# Altium schematic sheet 01-CM4_Conn.SchDoc
size C; SheetNumber: 1; SheetTotal: 13
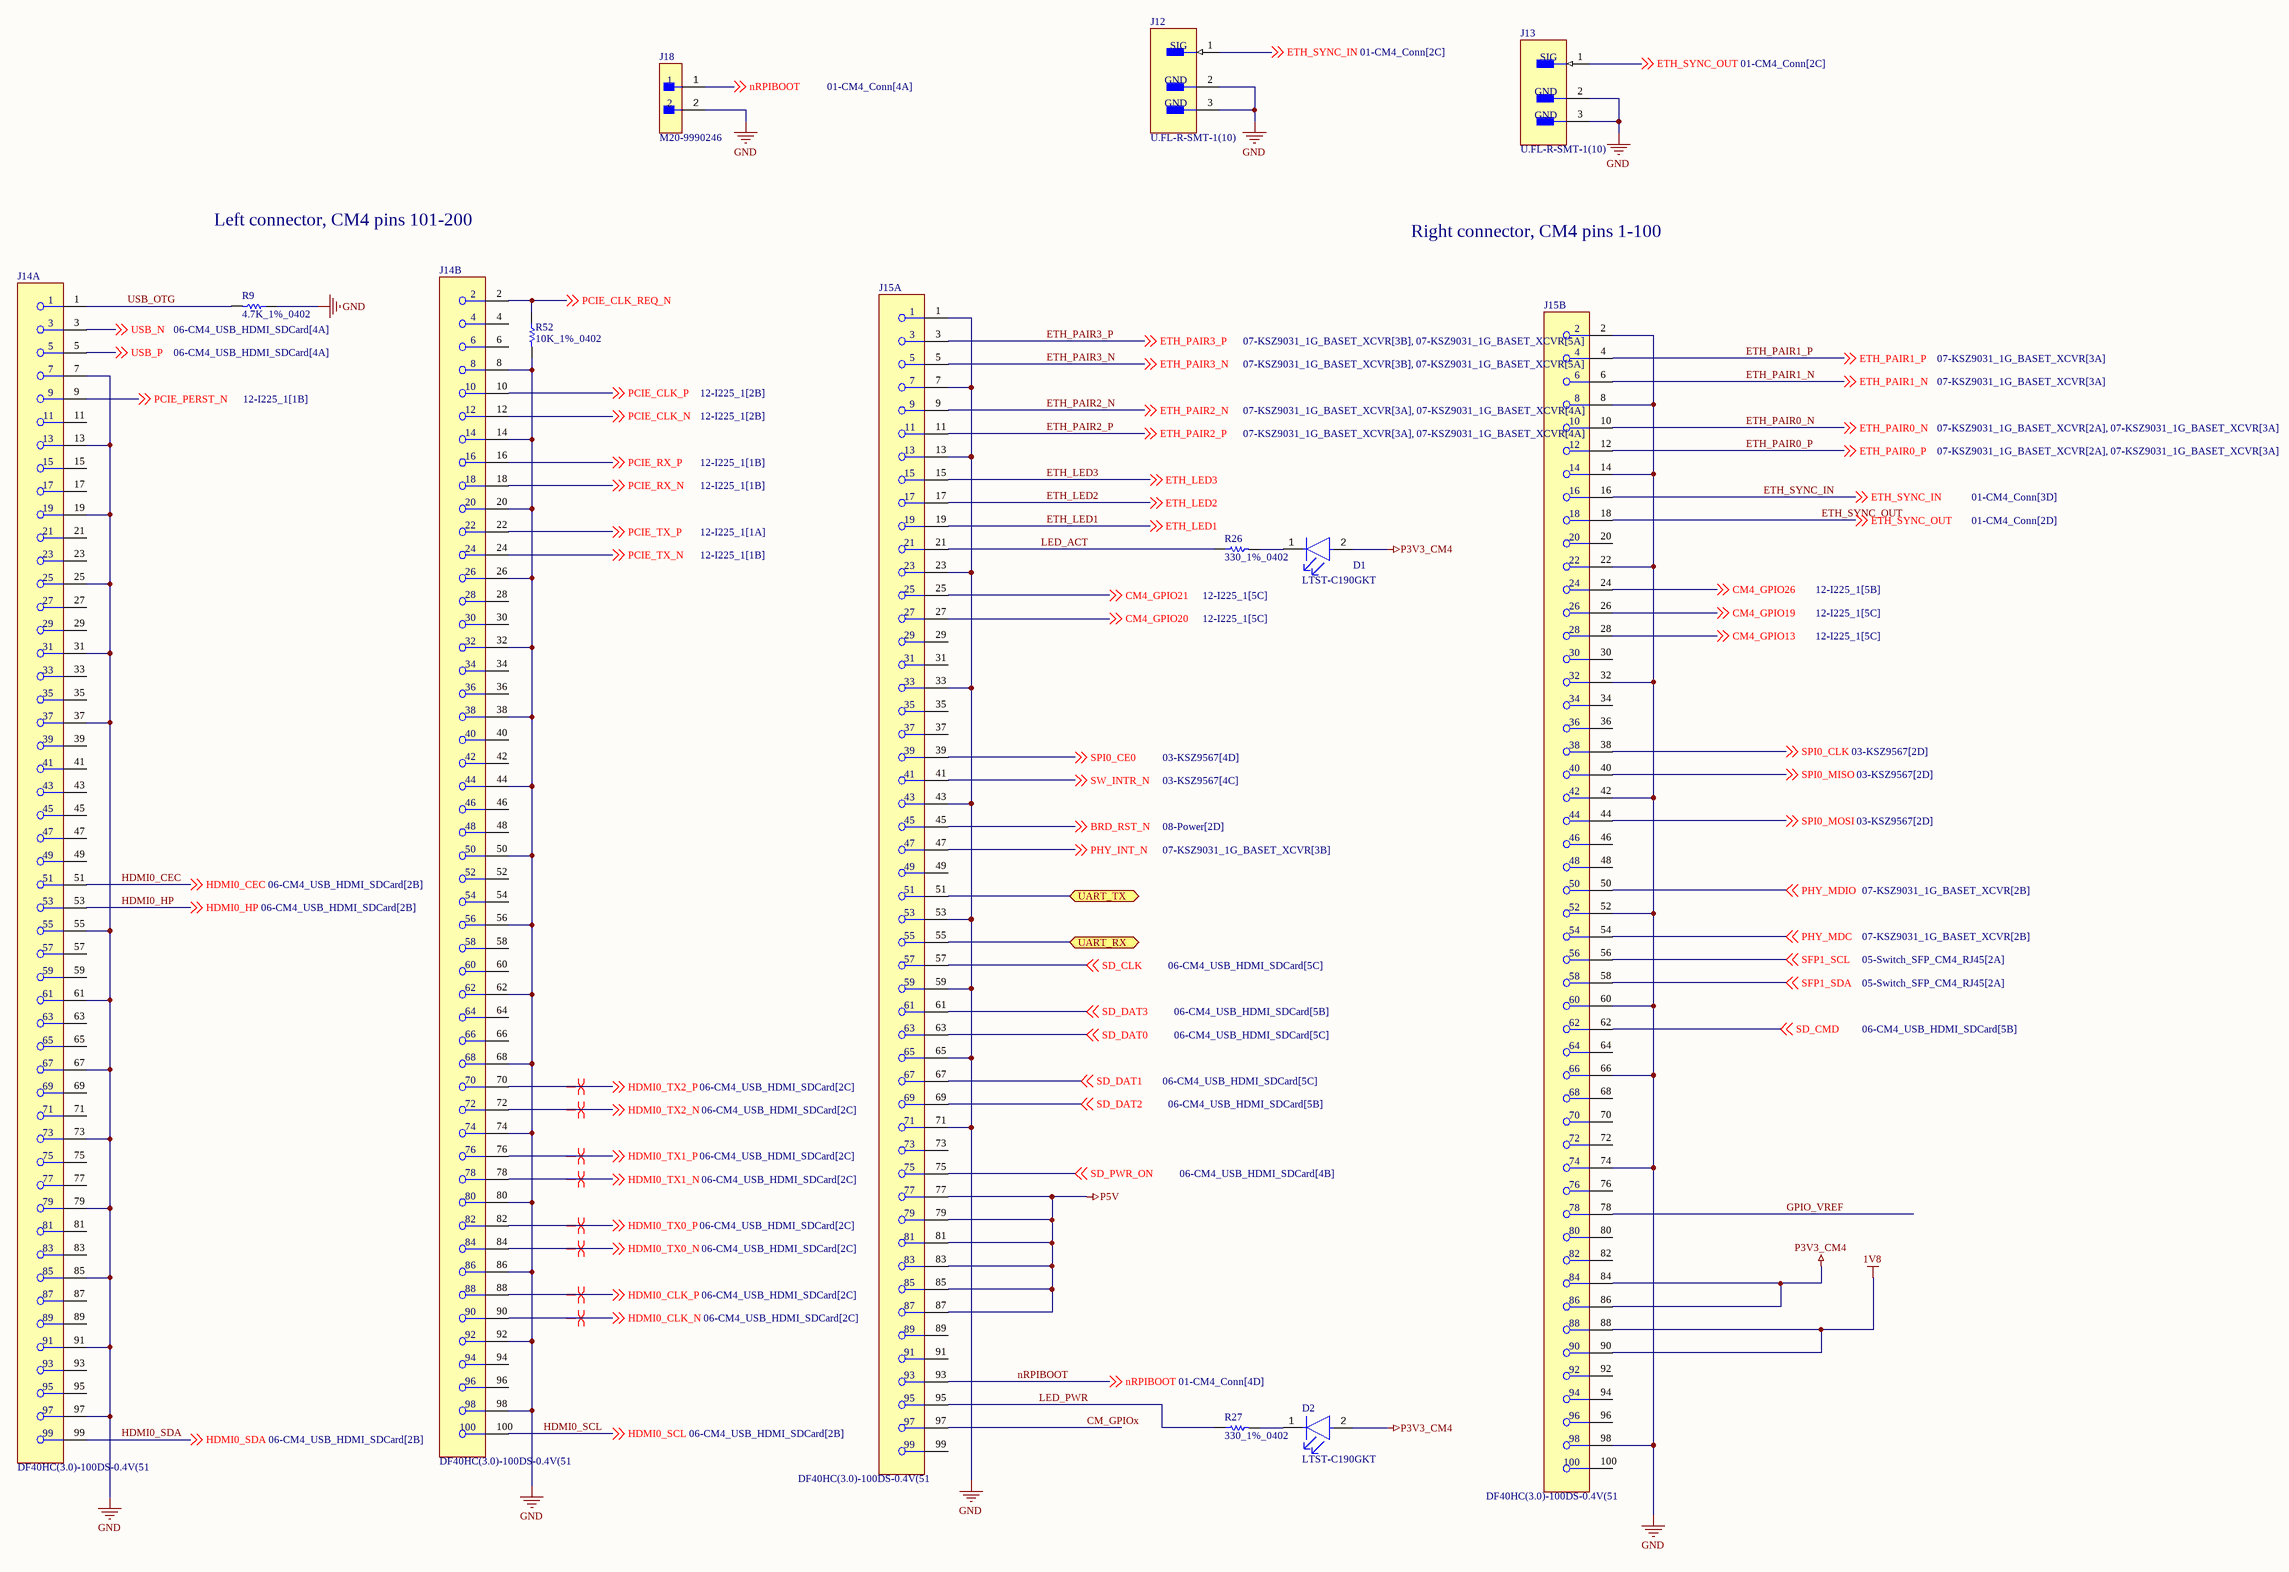
[diagram p0: 01-CM4_Conn.SchDoc]

## Parts
D1  LTST-C190GKT  [FP-LTST-C190GKT-MFG]
D2  LTST-C190GKT  [FP-LTST-C190GKT-MFG]
J12  U.FL-R-SMT-1(10)  [FP-U_FL-R-SMT-1_10-MFG]
J13  U.FL-R-SMT-1(10)  [FP-U_FL-R-SMT-1_10-MFG]
J14  DF40HC(3.0)-100DS-0.4V(51  [FP-DF40HC_3_0_-100DS-0_4V-MFG]  (parts A,B of 2)
J15  DF40HC(3.0)-100DS-0.4V(51  [FP-DF40HC_3_0_-100DS-0_4V-MFG]  (parts A,B of 2)
J18  M20-9990246  [FP-M20-9990246-MFG]
R9  4.7K_1%_0402  [RESC1005X40X25NL10T10]
R26  330_1%_0402  [RESC1005X40X25NL10T10]
R27  330_1%_0402  [RESC1005X40X25NL10T10]
R52  10K_1%_0402  [RESC1005X40X25NL10T10]

## Ports
UART_RX (bidir), UART_TX (bidir)

## Nets
1V8: J15.88 J15.90
GND: J12.2(GND) J12.3(GND) J13.2(GND) J13.3(GND) J14.7 J14.8 J14.13 J14.14 J14.19 J14.20 J14.25 J14.26 J14.31 J14.32 J14.37 J14.38 J14.44 J14.50 J14.55 J14.56 J14.61 J14.62 J14.67 J14.68 J14.73 J14.74 J14.79 J14.80 J14.85 J14.86 J14.91 J14.92 J14.97 J14.98 J15.1 J15.2 J15.7 J15.8 J15.13 J15.14 J15.22 J15.23 J15.32 J15.33 J15.42 J15.43 J15.52 J15.53 J15.59 J15.60 J15.65 J15.66 J15.71 J15.74 J15.98 J18.2 R9.1 R52.2
P3V3_CM4: D1.2(A) D2.2(A) J15.84 J15.86
P5V: J15.77 J15.79 J15.81 J15.83 J15.85 J15.87
BRD_RST_N: J15.45 ; off-sheet BRD_RST_N
CM4_GPIO13: J15.28 ; off-sheet CM4_GPIO13
CM4_GPIO19: J15.26 ; off-sheet CM4_GPIO19
CM4_GPIO20: J15.27 ; off-sheet CM4_GPIO20
CM4_GPIO21: J15.25 ; off-sheet CM4_GPIO21
CM4_GPIO26: J15.24 ; off-sheet CM4_GPIO26
CM_GPIOx: J15.97
ETH_LED1: J15.19 ; off-sheet ETH_LED1
ETH_LED2: J15.17 ; off-sheet ETH_LED2
ETH_LED3: J15.15 ; off-sheet ETH_LED3
ETH_PAIR0_N: J15.10 ; off-sheet ETH_PAIR0_N
ETH_PAIR0_P: J15.12 ; off-sheet ETH_PAIR0_P
ETH_PAIR1_N: J15.6 ; off-sheet ETH_PAIR1_N
ETH_PAIR1_P: J15.4 ; off-sheet ETH_PAIR1_P
ETH_PAIR2_N: J15.9 ; off-sheet ETH_PAIR2_N
ETH_PAIR2_P: J15.11 ; off-sheet ETH_PAIR2_P
ETH_PAIR3_N: J15.5 ; off-sheet ETH_PAIR3_N
ETH_PAIR3_P: J15.3 ; off-sheet ETH_PAIR3_P
ETH_SYNC_IN: J12.1(SIG) J15.16 ; off-sheet ETH_SYNC_IN
ETH_SYNC_OUT: J13.1(SIG) J15.18 ; off-sheet ETH_SYNC_OUT
GPIO_VREF: J15.78
HDMI0_CEC: J14.51 ; off-sheet HDMI0_CEC
HDMI0_CLK_N: J14.90 ; off-sheet HDMI0_CLK_N
HDMI0_CLK_P: J14.88 ; off-sheet HDMI0_CLK_P
HDMI0_HP: J14.53 ; off-sheet HDMI0_HP
HDMI0_SCL: J14.100 ; off-sheet HDMI0_SCL
HDMI0_SDA: J14.99 ; off-sheet HDMI0_SDA
HDMI0_TX0_N: J14.84 ; off-sheet HDMI0_TX0_N
HDMI0_TX0_P: J14.82 ; off-sheet HDMI0_TX0_P
HDMI0_TX1_N: J14.78 ; off-sheet HDMI0_TX1_N
HDMI0_TX1_P: J14.76 ; off-sheet HDMI0_TX1_P
HDMI0_TX2_N: J14.72 ; off-sheet HDMI0_TX2_N
HDMI0_TX2_P: J14.70 ; off-sheet HDMI0_TX2_P
LED_ACT: J15.21 R26.1
LED_PWR: J15.95 R27.1
nRPIBOOT: J15.93 J18.1 ; off-sheet nRPIBOOT
PCIE_CLK_N: J14.12 ; off-sheet PCIE_CLK_N
PCIE_CLK_P: J14.10 ; off-sheet PCIE_CLK_P
PCIE_CLK_REQ_N: J14.2 R52.1 ; off-sheet PCIE_CLK_REQ_N
PCIE_PERST_N: J14.9 ; off-sheet PCIE_PERST_N
PCIE_RX_N: J14.18 ; off-sheet PCIE_RX_N
PCIE_RX_P: J14.16 ; off-sheet PCIE_RX_P
PCIE_TX_N: J14.24 ; off-sheet PCIE_TX_N
PCIE_TX_P: J14.22 ; off-sheet PCIE_TX_P
PHY_INT_N: J15.47 ; off-sheet PHY_INT_N
PHY_MDC: J15.54 ; off-sheet PHY_MDC
PHY_MDIO: J15.50 ; off-sheet PHY_MDIO
SD_CLK: J15.57 ; off-sheet SD_CLK
SD_CMD: J15.62 ; off-sheet SD_CMD
SD_DAT0: J15.63 ; off-sheet SD_DAT0
SD_DAT1: J15.67 ; off-sheet SD_DAT1
SD_DAT2: J15.69 ; off-sheet SD_DAT2
SD_DAT3: J15.61 ; off-sheet SD_DAT3
SD_PWR_ON: J15.75 ; off-sheet SD_PWR_ON
SFP1_SCL: J15.56 ; off-sheet SFP1_SCL
SFP1_SDA: J15.58 ; off-sheet SFP1_SDA
SPI0_CE0: J15.39 ; off-sheet SPI0_CE0
SPI0_CLK: J15.38 ; off-sheet SPI0_CLK
SPI0_MISO: J15.40 ; off-sheet SPI0_MISO
SPI0_MOSI: J15.44 ; off-sheet SPI0_MOSI
SW_INTR_N: J15.41 ; off-sheet SW_INTR_N
UART_RX: J15.55 ; port UART_RX
UART_TX: J15.51 ; port UART_TX
USB_N: J14.3 ; off-sheet USB_N
USB_OTG: J14.1 R9.2
USB_P: J14.5 ; off-sheet USB_P
NetD1_1: D1.1(C) R26.2
NetD2_1: D2.1(C) R27.2

Not connected (* = marked no-connect by the designer): J14 4 6 11 15 17 21 23 27 28 29 30 33 34 35 36 39 40 41 42 43 45 46 47 48 49 52 54 57 58 59 60 63 64 65 66 69 71 75 77 81 83 87 89 93 94 95 96; J15 20 29 30 31 34 35 36 37 46 48 49 64 68 70 72 73 76 80 82 89 91 92 94 96 99 100

## Layout directives
differential pair: HDMI0_CLK_N, HDMI0_CLK_P, HDMI0_TX0_N, HDMI0_TX0_P, HDMI0_TX1_N, HDMI0_TX1_P, HDMI0_TX2_N, HDMI0_TX2_P

## Notes on the sheet
- Left connector, CM4 pins 101-200
- Right connector, CM4 pins 1-100
- DWG. NO.
- REV.
- SHT.
- REVISION
- DESCRIPTION
- DATE
- APPROVED
- THIS DOCUMENT AND THE DATA DISCLOSED HEREIN OR HEREWITH IS THE PROPERTY OF ALTIUM LIMITED AND MAY BE FREELY DISTRIBUTED IN WHOLE. NO RIGHTS ARE RESERVED OR EXPRESS OR IMPLIED WARANTEE GIVEN.
- ENG:
- DSN:
- APPROVALS
- PROJECT
- DOCUMENT REVISION:
- DESIGN ITEM:
- CHK:
- BOM:
- REFERENCE DOCUMENTS
- PROJECT REVISION:
- TITLE
- FAB DWG:
- PCB DWG:
- ASSY DWG:
- SCALE:
- SIZE
- C
- CAGE CODE
- FILE NAME
- DWG NO.
- SHEET
- OF
- REV

## Library data of the parts
D1 D2 = CMP-22017-000005-2: LED GREEN CLEAR CHIP SMD; Dominant Wavelength: 569nm; Reverse Voltage: 5V; Lens Color: Colorless; Viewing Angle: 130°; Voltage: 2V; Forward Current: 30mA; Power Dissipation: 100mW; Luminous Intensity: 6mcd; Number of LEDs: 1; Forward Voltage: 2.1V; Wavelength: 565nm; Test Current: 10mA; Min Operating Temperature: -55°C; Lens Style: Clear; Mount: Surface Mount; Width: 0.8mm; Packaging: Tape and Reel; Lens Transparency: Clear; Case Code (Metric): 1608; Depth: 0.8mm; Case Code (Imperial): 0603; Case/Package: 0603; Number of Pins: 2; Max Operating Temperature: 85°C; Lead Free: Lead Free; Number of Elements: 1; Length: 1.6mm; Height: 0.8mm; Package Quantity: 1; Power Rating: 100mW; Radiation Hardening: No; Illumination Color: Green; Color: Green
J12 J13 = CMP-2000-05152-3: CONN U.FL RCPT STR 50 OHM SMD; Max Frequency: 6GHz; Connector Type: Coaxial; Body Plating: Silver; Body Material: Bronze; Impedance: 50R; Dielectric Material: Polymer; Insulation Resistance: 500MR; Gender: Male; Packaging: Cut Tape; Length: 3mm; Package Quantity: 2500; Termination: Solder; Lead Free: Lead Free; Series: U.FL; Min Operating Temperature: -40°C; Fastening Type: Snap; Contact Material: Brass; Orientation: Straight; Wire/Cable Type: Coaxial; Frequency: 6GHz; Contact Plating: Gold; Depth: 3.1mm; Weight: 0.001764oz; Max Operating Temperature: 90°C; Radiation Hardening: No; REACH SVHC: No SVHC; Mount: Surface Mount; Housing Color: Beige
J14 J15 = CMP-11605-000071-1: CONN RCPT 100POS SMD GOLD; Pitch: 0.016inch; Number of Positions: 100; Connector Type: Receptacle; Package Quantity: 3000; Contact Plating: Gold; Series: DF40; Mount: Surface Mount; Number of Rows: 2; Packaging: Tape and Reel
J18 = CMP-15831-000009-1: CONN HEADER VERT 2POS 2.54MM; Manufacturer: Harwin; Conn Gender: Male; Conn Orientation: Vertical; Number Of Contacts: 2; Current Rating: 3A; ComponentLink2URL: https://cdn.harwin.com/pdfs/M20-999.pdf; ComponentLink2Description: Datasheet; Package: M20-9990246; Temperature: -40°C to +105°C; Octopart: https://octopart.com/m20-9990246-harwin-2590635; Mouser Description: 2.54mm (0.1") Pitch SIL Vertical PC Tail Pin Header, 6.1mm mating pin height, tin, 2 contacts; Temperature Range High: +105°C; Device Class L1: Connectors; RoHS: TRUE; Automotive: No; Height: 8.99mm; Number Of Rows: 1; Contact Material: Tin,Nickel; Category: Conn; Pitch: 2.54mm; Lead Free: Yes; Digikey Description: CONN HEADER VERT 2POS 2.54MM; Manufacturer Part Number: M20-9990246; Temperature Range Low: -40°C; Device Class L3: unset; Device Class L2: Headers and Wire Housings
R9 = CMP-2002-05217-1: Manufacturer: Bourns; Part Number: CR0402-FX-4701GLF
R26 R27 = CMP-2002-05853-1: Manufacturer: Panasonic; Part Number: ERA-2AED331X
R52 = CMP-2002-04694-1: Manufacturer: Bourns; Part Number: CR0402-FX-1002GLF